# Altium schematic sheet LMS7002M.SchDoc
size E
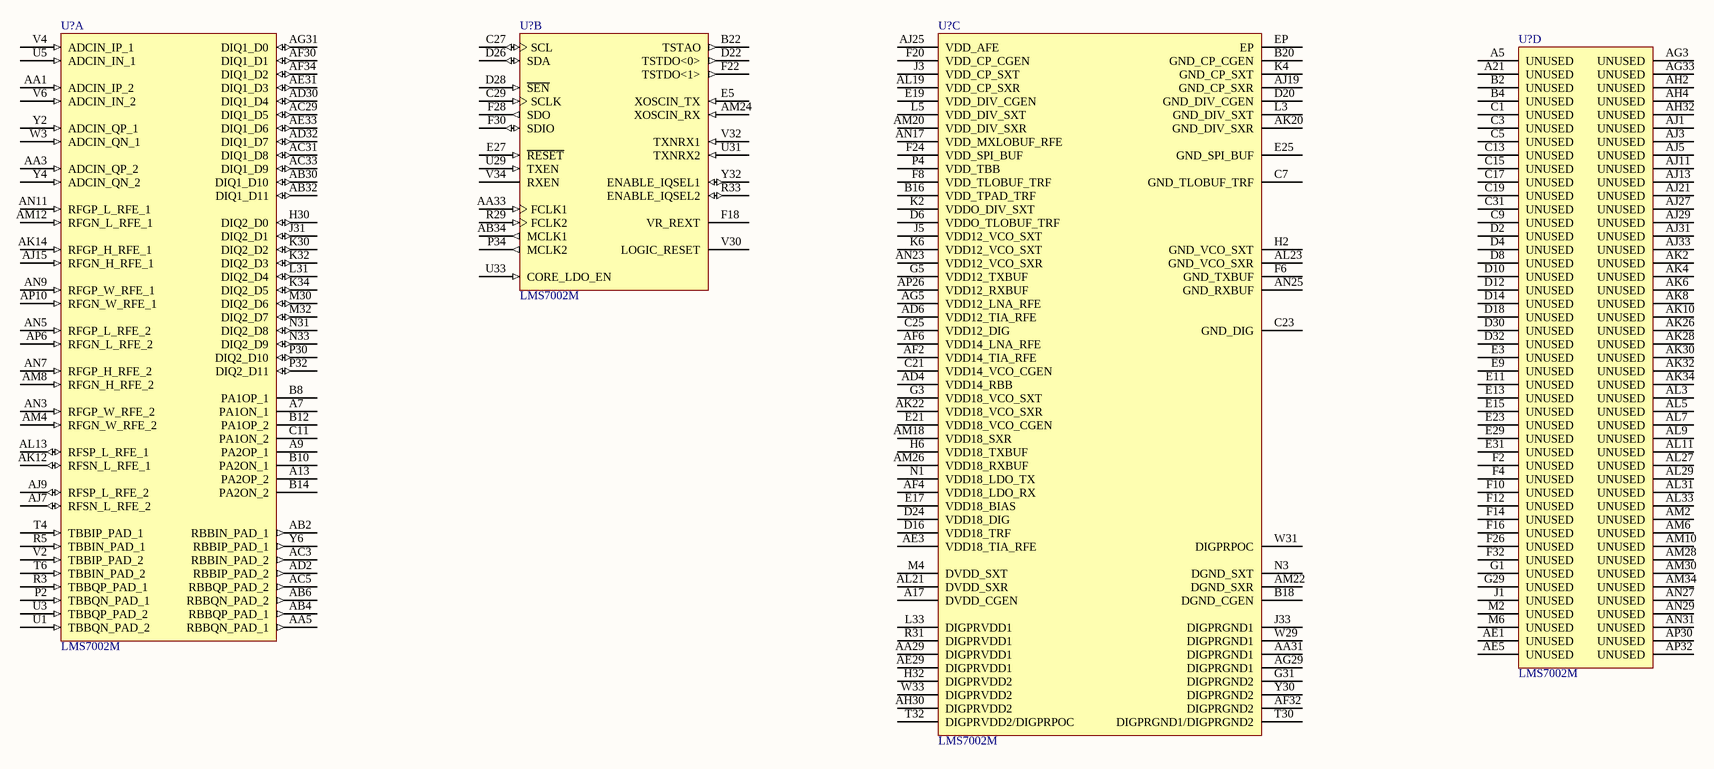
[diagram p0: LMS7002M.SchDoc]

## Parts
(Parts that share a designator on the sheet are numbered #1, #2 ... from top to bottom, then left to right.)
U?#1  LMS7002M  [LM-QFN-261_V]  (part A of 4)
U?#2  LMS7002M  [LM-QFN-261_V]  (part B of 4)
U?#3  LMS7002M  [LM-QFN-261_V]  (part C of 4)
U?#4  LMS7002M  [LM-QFN-261_V]  (part D of 4)

## Nets

Not connected (* = marked no-connect by the designer): U?#1 A7(PA1ON_1) A9(PA2OP_1) A13(PA2OP_2) AA1(ADCIN_IP_2) AA3(ADCIN_QP_2) AA5(RBBQN_PAD_1) AB2(RBBIN_PAD_1) AB4(RBBQP_PAD_1) AB6(RBBQN_PAD_2) AB30(DIQ1_D10) AB32(DIQ1_D11) AC3(RBBIN_PAD_2) AC5(RBBQP_PAD_2) AC29(DIQ1_D5) AC31(DIQ1_D8) AC33(DIQ1_D9) AD2(RBBIP_PAD_2) AD30(DIQ1_D4) AD32(DIQ1_D7) AE31(DIQ1_D3) AE33(DIQ1_D6) AF30(DIQ1_D1) AF34(DIQ1_D2) AG31(DIQ1_D0) AJ7(RFSN_L_RFE_2) AJ9(RFSP_L_RFE_2) AJ15(RFGN_H_RFE_1) AK12(RFSN_L_RFE_1) AK14(RFGP_H_RFE_1) AL13(RFSP_L_RFE_1) AM4(RFGN_W_RFE_2) AM8(RFGN_H_RFE_2) AM12(RFGN_L_RFE_1) AN3(RFGP_W_RFE_2) AN5(RFGP_L_RFE_2) AN7(RFGP_H_RFE_2) AN9(RFGP_W_RFE_1) AN11(RFGP_L_RFE_1) AP6(RFGN_L_RFE_2) AP10(RFGN_W_RFE_1) B8(PA1OP_1) B10(PA2ON_1) B12(PA1OP_2) B14(PA2ON_2) C11(PA1ON_2) H30(DIQ2_D0) J31(DIQ2_D1) K30(DIQ2_D2) K32(DIQ2_D3) K34(DIQ2_D5) L31(DIQ2_D4) M30(DIQ2_D6) M32(DIQ2_D7) N31(DIQ2_D8) N33(DIQ2_D9) P2(TBBQN_PAD_1) P30(DIQ2_D10) P32(DIQ2_D11) R3(TBBQP_PAD_1) R5(TBBIN_PAD_1) T4(TBBIP_PAD_1) T6(TBBIN_PAD_2) U1(TBBQN_PAD_2) U3(TBBQP_PAD_2) U5(ADCIN_IN_1) V2(TBBIP_PAD_2) V4(ADCIN_IP_1) V6(ADCIN_IN_2) W3(ADCIN_QN_1) Y2(ADCIN_QP_1) Y4(ADCIN_QN_2) Y6(RBBIP_PAD_1); U?#2 AA33(FCLK1) AB34(MCLK1) AM24(XOSCIN_RX) B22(TSTAO) C27(SCL) C29(SCLK) D22(TSTDO<0>) D26(SDA) D28(~{SEN}) E5(XOSCIN_TX) E27(~{RESET}) F18(VR_REXT) F22(TSTDO<1>) F28(SDO) F30(SDIO) P34(MCLK2) R29(FCLK2) R33(ENABLE_IQSEL2) U29(TXEN) U31(TXNRX2) U33(CORE_LDO_EN) V30(LOGIC_RESET) V32(TXNRX1) V34(RXEN) Y32(ENABLE_IQSEL1); U?#3 A17(DVDD_CGEN) AA29(DIGPRVDD1) AA31(DIGPRGND1) AD4(VDD14_RBB) AD6(VDD12_TIA_RFE) AE3(VDD18_TIA_RFE) AE29(DIGPRVDD1) AF2(VDD14_TIA_RFE) AF4(VDD18_LDO_RX) AF6(VDD14_LNA_RFE) AF32(DIGPRGND2) AG5(VDD12_LNA_RFE) AG29(DIGPRGND1) AH30(DIGPRVDD2) AJ19(GND_CP_SXR) AJ25(VDD_AFE) AK20(GND_DIV_SXR) AK22(VDD18_VCO_SXR) AL19(VDD_CP_SXR) AL21(DVDD_SXR) AL23(GND_VCO_SXR) AM18(VDD18_SXR) AM20(VDD_DIV_SXR) AM22(DGND_SXR) AM26(VDD18_RXBUF) AN17(VDD_MXLOBUF_RFE) AN23(VDD12_VCO_SXR) AN25(GND_RXBUF) AP26(VDD12_RXBUF) B16(VDD_TPAD_TRF) B18(DGND_CGEN) B20(GND_CP_CGEN) C7(GND_TLOBUF_TRF) C21(VDD14_VCO_CGEN) C23(GND_DIG) C25(VDD12_DIG) D6(VDDO_TLOBUF_TRF) D16(VDD18_TRF) D20(GND_DIV_CGEN) D24(VDD18_DIG) E17(VDD18_BIAS) E19(VDD_DIV_CGEN) E21(VDD18_VCO_CGEN) E25(GND_SPI_BUF) EP F6(GND_TXBUF) F8(VDD_TLOBUF_TRF) F20(VDD_CP_CGEN) F24(VDD_SPI_BUF) G3(VDD18_VCO_SXT) G5(VDD12_TXBUF) G31(DIGPRGND2) H2(GND_VCO_SXT) H6(VDD18_TXBUF) H32(DIGPRVDD2) J3(VDD_CP_SXT) J5(VDD12_VCO_SXT) J33(DIGPRGND1) K2(VDDO_DIV_SXT) K4(GND_CP_SXT) K6(VDD12_VCO_SXT) L3(GND_DIV_SXT) L5(VDD_DIV_SXT) L33(DIGPRVDD1) M4(DVDD_SXT) N1(VDD18_LDO_TX) N3(DGND_SXT) P4(VDD_TBB) R31(DIGPRVDD1) T30(DIGPRGND1/DIGPRGND2) T32(DIGPRVDD2/DIGPRPOC) W29(DIGPRGND1) W31(DIGPRPOC) W33(DIGPRVDD2) Y30(DIGPRGND2); U?#4 A5(UNUSED) A21(UNUSED) AE1(UNUSED) AE5(UNUSED) AG3(UNUSED) AG33(UNUSED) AH2(UNUSED) AH4(UNUSED) AH32(UNUSED) AJ1(UNUSED) AJ3(UNUSED) AJ5(UNUSED) AJ11(UNUSED) AJ13(UNUSED) AJ21(UNUSED) AJ27(UNUSED) AJ29(UNUSED) AJ31(UNUSED) AJ33(UNUSED) AK2(UNUSED) AK4(UNUSED) AK6(UNUSED) AK8(UNUSED) AK10(UNUSED) AK26(UNUSED) AK28(UNUSED) AK30(UNUSED) AK32(UNUSED) AK34(UNUSED) AL3(UNUSED) AL5(UNUSED) AL7(UNUSED) AL9(UNUSED) AL11(UNUSED) AL27(UNUSED) AL29(UNUSED) AL31(UNUSED) AL33(UNUSED) AM2(UNUSED) AM6(UNUSED) AM10(UNUSED) AM28(UNUSED) AM30(UNUSED) AM34(UNUSED) AN27(UNUSED) AN29(UNUSED) AN31(UNUSED) AP30(UNUSED) AP32(UNUSED) B2(UNUSED) B4(UNUSED) C1(UNUSED) C3(UNUSED) C5(UNUSED) C9(UNUSED) C13(UNUSED) C15(UNUSED) C17(UNUSED) C19(UNUSED) C31(UNUSED) D2(UNUSED) D4(UNUSED) D8(UNUSED) D10(UNUSED) D12(UNUSED) D14(UNUSED) D18(UNUSED) D30(UNUSED) D32(UNUSED) E3(UNUSED) E9(UNUSED) E11(UNUSED) E13(UNUSED) E15(UNUSED) E23(UNUSED) E29(UNUSED) E31(UNUSED) F2(UNUSED) F4(UNUSED) F10(UNUSED) F12(UNUSED) F14(UNUSED) F16(UNUSED) F26(UNUSED) F32(UNUSED) G1(UNUSED) G29(UNUSED) J1(UNUSED) M2(UNUSED) M6(UNUSED)

## Library data of the parts
U?#1-U?#4 = CMP-2000-06561-1: FPRF MIMO Transceiver IC with Integrated Microcontroller, 1.1 to 1.89 V, -40 to 85 degC, 261-Pin QFN, RoHS; Manufacturer: LimeMicrosystemsLtd; Current - Receiving: 420mA; Protocol: CDMA,GSM,HSPA,LTE,TD-SCDMA,WCDMA; Frequency: 100kHz~3.8GHz; Current - Transmitting: 350mA; Memory Size: 10kBSRAM; Power - Output: 0dBm; Serial Interfaces: SPI; RF Family/Standard: Cellular; Voltage - Supply: 1.1V~1.89V; GPIO: -; Data Rate (Max): -; Family: RFTransceiverICs; Modulation: -; Mounting Technology: SurfaceMount; Datasheet URL: http://www.richardsonrfpd.com/resources/RellDocuments/SYS_31/LMS7002M.pdf; Package Description: 261-Pin Quad Flat No-lead Package, Body 11.5 x 11.5 mm, Pitch 0.666 mm; Series: -; Sensitivity: -; Category: RF/IFandRFID; Package Reference: QFN-261; Package / Case: 261-SMDModule; Package URL: http://cdn.limemicro.com/wp-content/uploads/2015/08/LMS7002M-PCB-Layout-Recommendations-1.0r5.pdf; Operating Temperature: -40°C~85°C; Manufacturer URL: http://www.limemicro.com/; Packaging: Tray; Datasheet Version: Rev. 2.8.0, 09/2015; Type: TxRx+MCU